# EAGLE schematic AudioMega v101 (EAGLE 6.2)
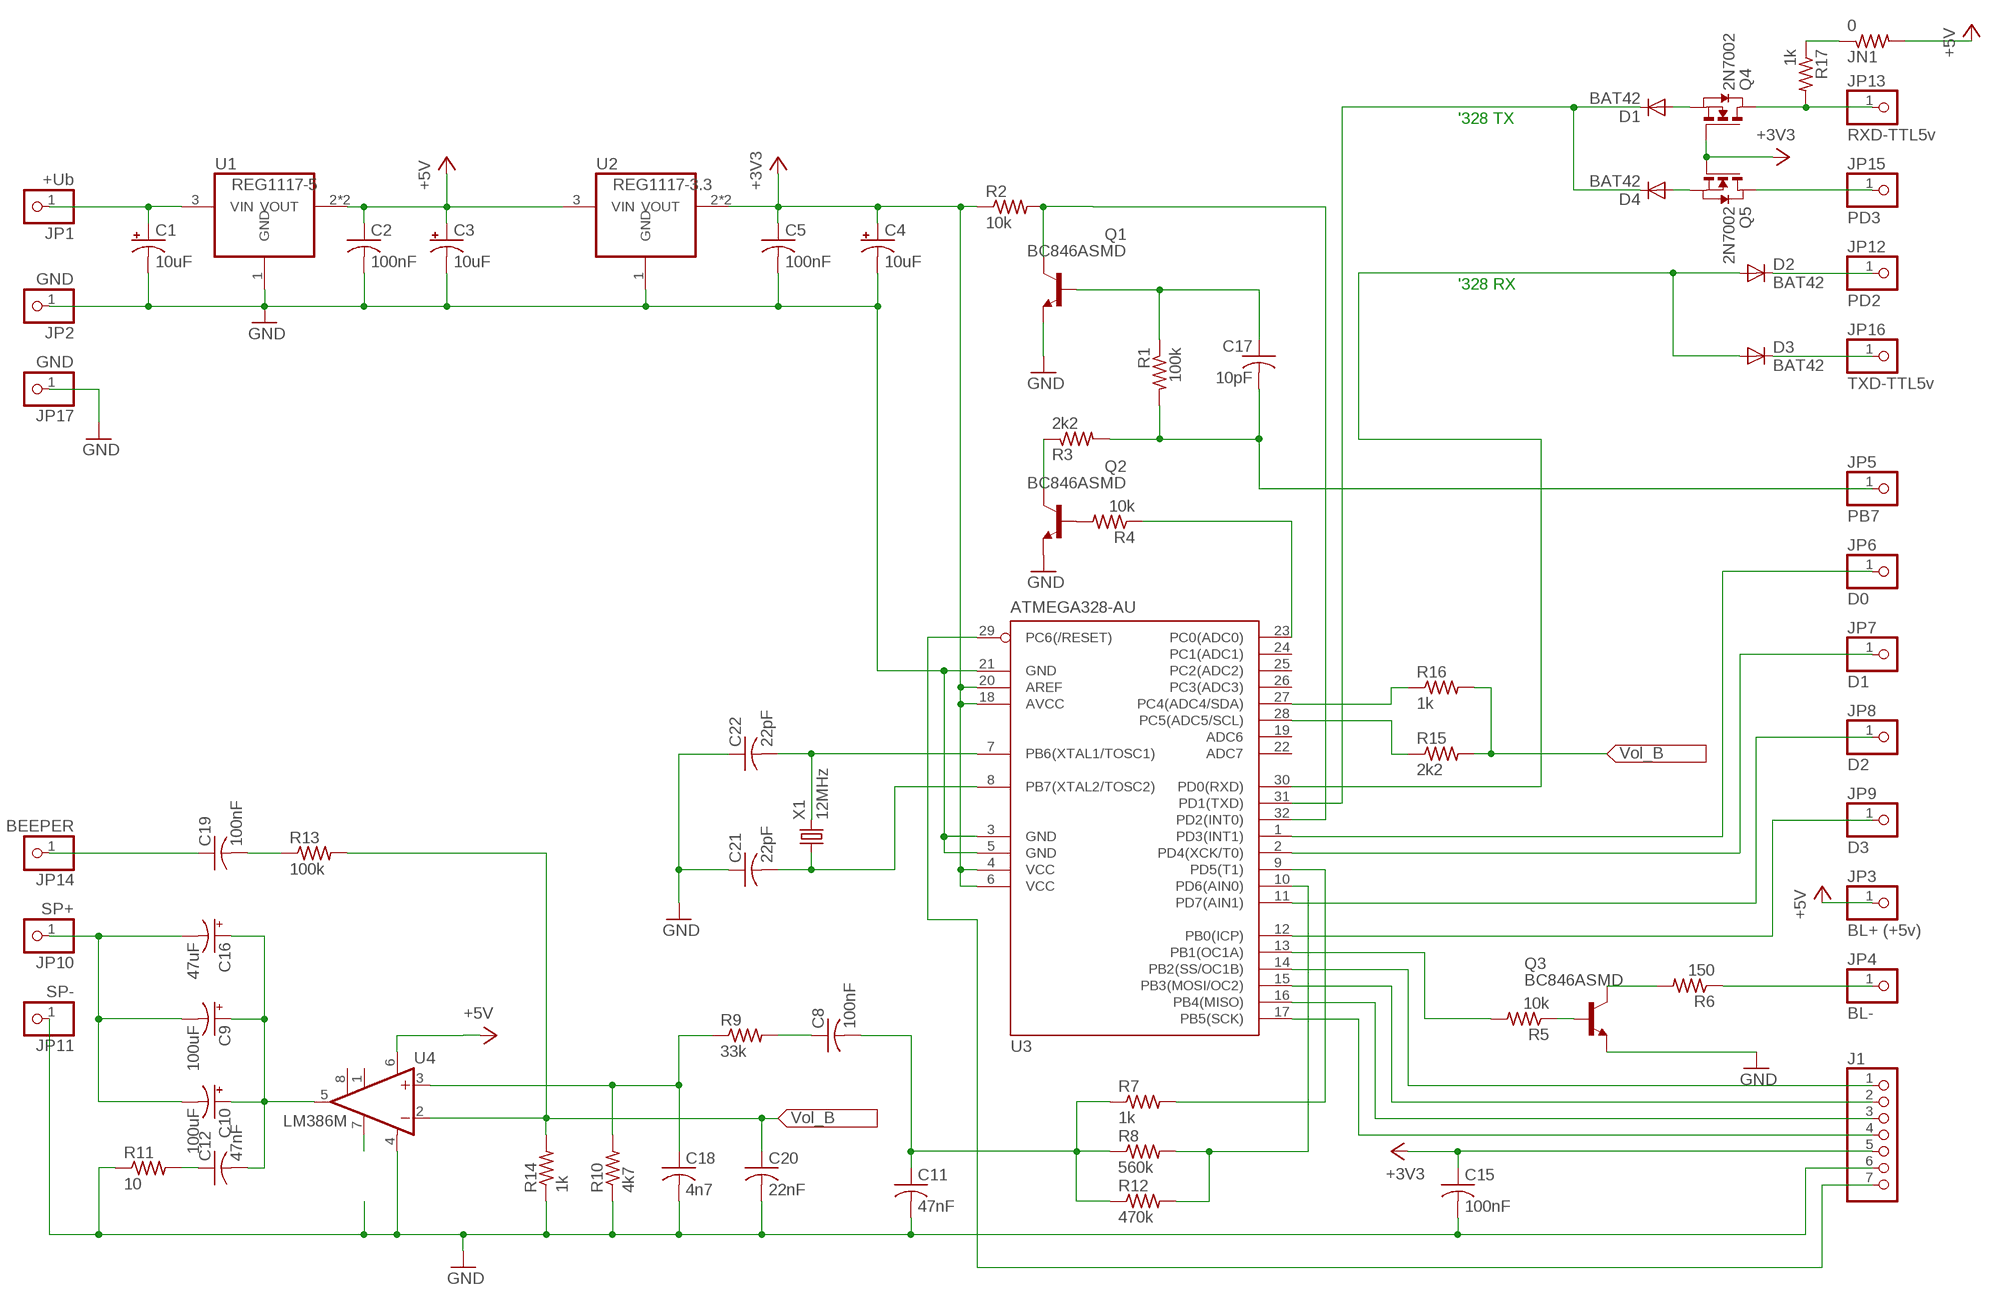
[diagram p0: schematic, sheet 1]

## Parts
C1  10uF  CPOL-USCT3528  [CT3528]
C2  100nF  C-USC1206  [C1206]
C3  10uF  CPOL-USCT3528  [CT3528]
C4  10uF  CPOL-USCT3528  [CT3528]
C5  100nF  C-USC1206  [C1206]
C8  100nF  C-USC1206  [C1206]
C9  100uF  CPOL-USCT6032  [CT6032]
C10  100uF  CPOL-USCT6032  [CT6032]
C11  47nF  C-USC1206  [C1206]
C12  47nF  C-USC1206  [C1206]
C15  100nF  C-USC1206  [C1206]
C16  47uF  CPOL-USCT6032  [CT6032]
C17  10pF  C-USC1206  [C1206]
C18  4n7  C-USC1206  [C1206]
C19  100nF  C-USC1206  [C1206]
C20  22nF  C-USC1206  [C1206]
C21  22pF  C-USC1206  [C1206]
C22  22pF  C-USC1206  [C1206]
D1  BAT42  DIODE-SOD123  [SOD123]
D2  BAT42  DIODE-SOD123  [SOD123]
D3  BAT42  DIODE-SOD123  [SOD123]
D4  BAT42  DIODE-SOD123  [SOD123]
J1  PINHD-1X7  [1X07]
JN1  0  R-US_R1206  [R1206]
JP1  +Ub  PINHD-1X1  [1X01]
JP2  GND  PINHD-1X1  [1X01]
JP3  BL+ (+5v)  PINHD-1X1  [1X01]
JP4  BL-  PINHD-1X1  [1X01]
JP5  PB7  PINHD-1X1  [1X01]
JP6  D0  PINHD-1X1  [1X01]
JP7  D1  PINHD-1X1  [1X01]
JP8  D2  PINHD-1X1  [1X01]
JP9  D3  PINHD-1X1  [1X01]
JP10  SP+  PINHD-1X1  [1X01]
JP11  SP-  PINHD-1X1  [1X01]
JP12  PD2  PINHD-1X1  [1X01]
JP13  RXD-TTL5v  PINHD-1X1  [1X01]
JP14  BEEPER  PINHD-1X1  [1X01]
JP15  PD3  PINHD-1X1  [1X01]
JP16  TXD-TTL5v  PINHD-1X1  [1X01]
JP17  GND  PINHD-1X1  [1X01]
Q1  BC846ASMD  [SOT23]
Q2  BC846ASMD  [SOT23]
Q3  BC846ASMD  [SOT23]
Q4  2N7002  NMOSSOT23  [SOT-23]
Q5  2N7002  NMOSSOT23  [SOT-23]
R1  100k  R-US_R1206  [R1206]
R2  10k  R-US_R1206  [R1206]
R3  2k2  R-US_R1206  [R1206]
R4  10k  R-US_R1206  [R1206]
R5  10k  R-US_R1206  [R1206]
R6  150  R-US_R1206  [R1206]
R7  1k  R-US_R1206  [R1206]
R8  560k  R-US_R1206  [R1206]
R9  33k  R-US_R1206  [R1206]
R10  4k7  R-US_R1206  [R1206]
R11  10  R-US_R1206  [R1206]
R12  470k  R-US_R1206  [R1206]
R13  100k  R-US_R1206  [R1206]
R14  1k  R-US_R1206  [R1206]
R15  2k2  R-US_R1206  [R1206]
R16  1k  R-US_R1206  [R1206]
R17  1k  R-US_R1206  [R1206]
U1  REG1117-5  REG1117  [SOT223]
U2  REG1117-3.3  REG1117  [SOT223]
U3  ATMEGA328-AU  MEGA8-AI  [TQFP32-08]
U4  LM386M  LM386M-1  [SO08]
X1  12MHz  CRYSTALHC49UP  [HC49UP]

## Nets
+3V3: C4.+ C5.1 C15.1 J1.5 Q4.3(G) Q5.3(G) R2.1 U2.2(VOUT) U2.4(VOUT) U3.4(VCC) U3.6(VCC) U3.18(AVCC) U3.20(AREF)
+5V: C2.1 C3.+ JN1.2 JP3.1 U1.2(VOUT) U1.4(VOUT) U2.3(VIN) U4.6(VS)
B7: C17.2 JP5.1 R1.2 R3.2
CLK: Q1.3(C) R2.2 U3.32(PD2(INT0))
GND: C1.- C2.2 C3.- C4.- C5.2 C11.2 C15.2 C18.2 C20.2 C21.1 C22.1 J1.6 JP2.1 JP11.1 JP17.1 Q1.2(E) Q2.2(E) Q3.2(E) R10.1 R11.1 R14.1 U1.1(GND) U2.1(GND) U3.3(GND) U3.5(GND) U3.21(GND) U4.4(GND)
N$1: R4.1 U3.23(PC0(ADC0))
N$2: D4.A Q5.2(S)
N$3: J1.2 U3.15(PB3(MOSI/OC2))
N$4: J1.3 U3.16(PB4(MISO))
N$5: J1.4 U3.17(PB5(SCK))
N$6: J1.7 U3.29(PC6(/RESET))
N$7: C22.2 U3.7(PB6(XTAL1/TOSC1)) X1.2
N$8: C21.2 U3.8(PB7(XTAL2/TOSC2)) X1.1
N$9: Q2.1(B) R4.2
N$10: R16.1 U3.27(PC4(ADC4/SDA))
N$11: R15.1 U3.28(PC5(ADC5/SCL))
N$12: Q2.3(C) R3.1
N$13: C17.1 Q1.1(B) R1.1
N$14: U4.7(BYPASS)
N$15: C9.- C10.- C16.- JP10.1
N$16: C12.1 R11.2
N$17: C9.+ C10.+ C12.2 C16.+ U4.5(OUT)
N$18: C18.1 R9.1 R10.2 U4.3(+IN)
N$19: C19.1 JP14.1
N$20: C19.2 R13.1
N$21: J1.1 U3.14(PB2(SS/OC1B))
N$22: JN1.1 R17.1
N$24: C8.1 R9.2
N$25: C8.2 C11.1 R7.1 R8.1 R12.1
N$26: Q3.3(C) R6.2
N$27: R7.2 U3.9(PD5(T1))
N$28: R8.2 R12.2 U3.10(PD6(AIN0))
N$29: JP4.1 R6.1
N$30: JP9.1 U3.12(PB0(ICP))
N$31: JP8.1 U3.11(PD7(AIN1))
N$32: C1.+ JP1.1 U1.3(VIN)
N$33: Q3.1(B) R5.1
N$34: R5.2 U3.13(PB1(OC1A))
N$35: JP7.1 U3.2(PD4(XCK/T0))
N$36: JP6.1 U3.1(PD3(INT1))
N$37: D3.C JP16.1
N$38: JP15.1 Q5.1(D)
N$39: D2.C JP12.1
N$41: JP13.1 Q4.1(D) R17.2
N$42: D2.A D3.A U3.30(PD0(RXD))
N$45: D1.A Q4.2(S)
N$46: D1.C D4.C U3.31(PD1(TXD))
VOL_B: C20.1 R13.2 R14.2 R15.2 R16.2 U4.2(-IN)
Unconnected: U3.19(ADC6) U3.22(ADC7) U3.24(PC1(ADC1)) U3.25(PC2(ADC2)) U3.26(PC3(ADC3)) U4.1(GAIN) U4.8(GAIN)

## Notes on the sheet
- '328 TX
- '328 RX

## Library data of the parts
C1 C3 C4 C9 C10 C16 = resistor:CPOL-US: POLARIZED CAPACITOR, American symbol
C2 C5 C8 C11 C12 C15 C17-C22 = resistor:C-US: CAPACITOR, American symbol
D1-D4 = diode:DIODE-: DIODE
J1 = pinhead:PINHD-1X7: PIN HEADER
JN1 R1-R17 = resistor:R-US_: RESISTOR, American symbol
JP1-JP17 = pinhead:PINHD-1X1: PIN HEADER
Q1-Q3 = transistor-npn:BC846*: NPN Transistor
Q4 Q5 = zetex:NMOSSOT23: MOS FET; OC_FARNELL: unknown; OC_NEWARK: unknown
U1 U2 = burr-brown:REG1117: 800mA and 1A Low Dropout (LDO) Positive Regulator 1.8V, 2.5V, 2.85V, 3.3V, 5V, and Adj; MPN: REG1117; OC_FARNELL: 1097566; OC_NEWARK: 14P6981
U3 = atmel:MEGA8: MICROCONTROLLER 8 Kbytes FLASH, 1 kbytes SRAM, 512 bytes EEPROM, USART, 6-channel 10 bit ADC, 2-channel 8 bit ADC Pin compatible with Atmega48, ATMega88, ATMega168 Source: avr.lbr; MPN: ATMEGA8-16AU; OC_FARNELL: 9171371; OC_NEWARK: 73M8863
U4 = linear:LM386?-*: Low Voltage Audio Power Amplifier Source: http://cache.national.com/ds/LM/LM386.pdf
X1 = crystal:CRYSTAL: CRYSTAL; OC_FARNELL: unknown; OC_NEWARK: unknown